# EAGLE design GOTEK Speaker Circuit - On Board (EAGLE 9.6.1)
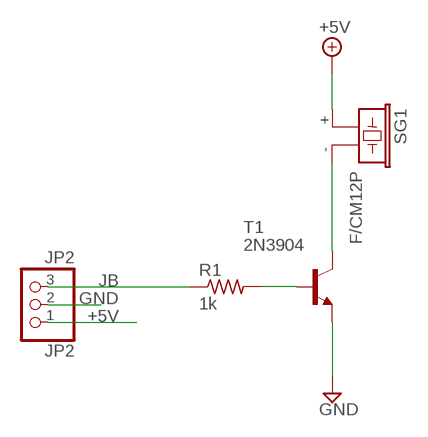
[diagram p0: schematic, sheet 1]

## Parts
JP2  JP2  PINHD-1X3  [1X03]
R1  1k  R-US_0204/7  [0204/7]
SG1  F/CM12P  [F/CM12P]
T1  2N3904  [TO92]

## Nets
+5V: JP2.1 SG1.+
GND: JP2.2 T1.3(E)
JB: JP2.3 R1.1
N$2: R1.2 T1.2(B)
SPK-: SG1.- T1.1(C)

## Library data of the parts
JP2 = pinhead:PINHD-1X3: PIN HEADER
R1 = rcl:R-US_: RESISTOR, American symbol; SPICEPREFIX: R
SG1 = buzzer:F/CM12P: BUZZER Source: Buerklin; OC_FARNELL: unknown; OC_NEWARK: unknown
T1 = transistor:2N3904: NPN TRANSISTOR

## Board
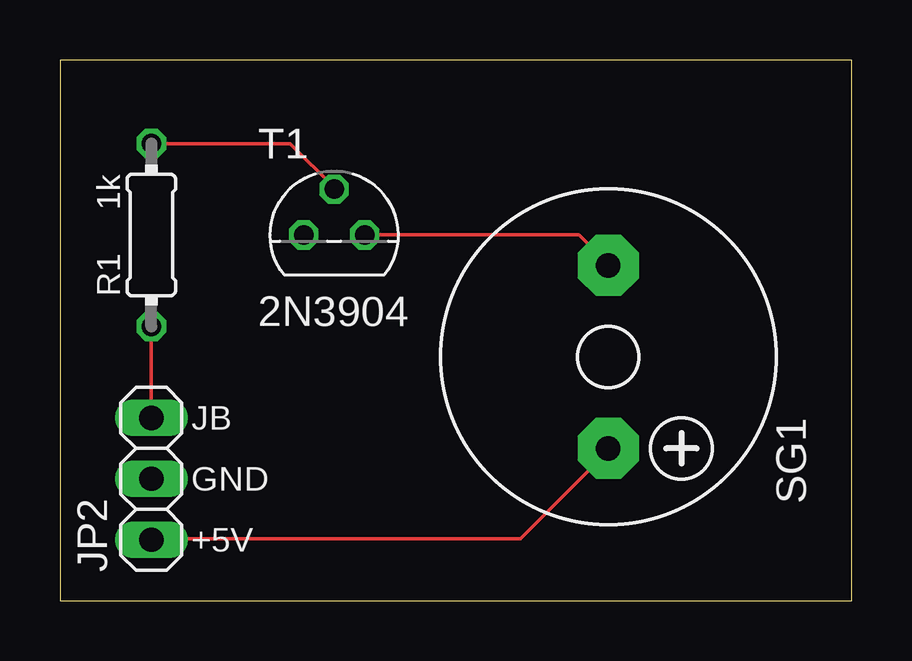
[diagram p1: board, top side]
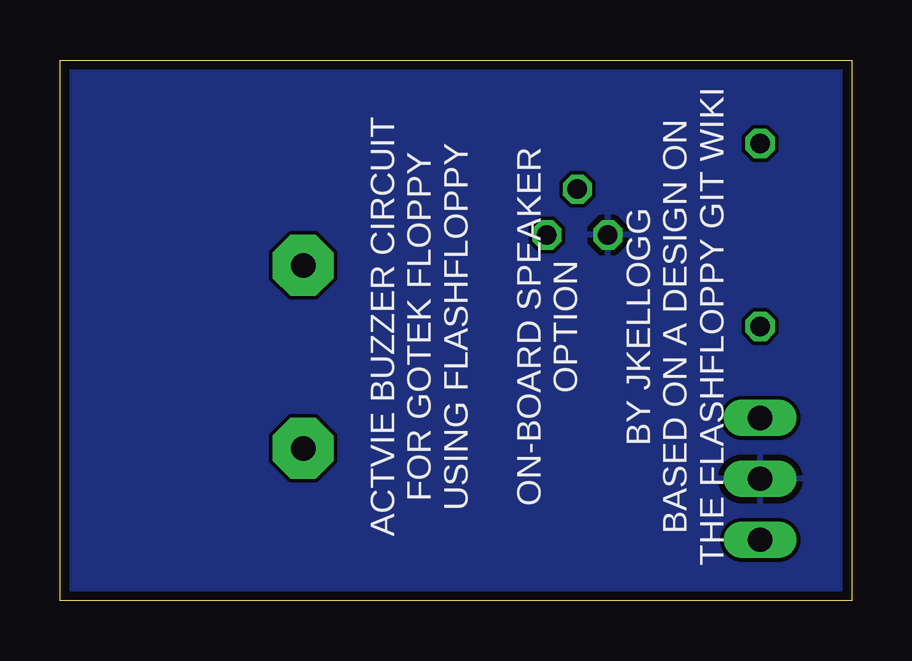
[diagram p2: board, bottom side, seen from below]

Size 33 x 22.53 mm. Coordinates in mm from the lower left corner, seen from the top.
Outline: 0,0 33,0 33,22.53 0,22.53 0,0
Copper layers (1*16): Top 0.035559375mm / dielectric 1.6mm / Bottom 0.035559375mm
Design rules "oshpark-2layer": minimum track width 6mil, minimum drill 10mil, track to track 6mil, track to pad 6mil, pad to pad 6mil, via to via 6mil, smd to smd 6mil, copper to edge 15mil, drill to drill 6mil, minimum pad ring 5mil, minimum via ring 5mil, stop-mask expansion 2.5mil, vias tented up to drill 0mil, thermal gap 10mil

### Footprints (pad centres in the part's own frame; a part is rotated, then mirrored left to right if it is on the bottom)
1X03 = drill 1.016 long: 1 -2.54,0; 2 0,0; 3 2.54,0
0204/7 = drill 0.813 octagon: 1 -3.81,0; 2 3.81,0
F/CM12P = drill 1.016 pad 2.54 octagon: + 3.81,0; - -3.81,0
TO92 = drill 0.813 octagon: 1 1.27,0; 2 0,1.905; 3 -1.27,0

### Placement (x,y rotation side)
JP2  3.81,5.08 90 top
R1  3.81,15.24 90 top
SG1  22.86,10.16 270 top
T1  11.43,15.24 0 top

### Tracks (layer width: path | path; a pad name or v marks a point on that pad's centre or on a via)
+5V
  Top 0.152: JP2.1 3.81,2.59 19.2,2.59 22.86,6.25 SG1.+
GND
  pour Bottom: 0,0 33.02,0 33.02,22.86 0,22.86
JB
  Top 0.152: JP2.3 R1.1
N$2
  Top 0.152: R1.2 9.6,19.05 11.43,17.22 T1.2
SPK-
  Top 0.152: T1.1 21.64,15.24 22.86,14.02 SG1.-

### Text on the board
tPlace: JB | GND | +5V
bPlace: ACTVIE BUZZER CIRCUIT / FOR GOTEK FLOPPY / USING FLASHFLOPPY / / ON-BOARD SPEAKER / OPTION / / BY JKELLOGG / BASED ON A DESIGN ON / THE FLASHFLOPPY GIT WIKI